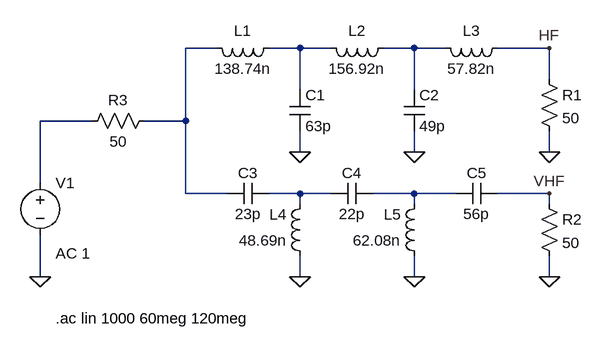
[diagram p0: schematic diplexer.asc]
diplexer.asc, the LTspice schematic file:
Version 4
SHEET 1 880 680
WIRE 224 -64 176 -64
WIRE 352 -64 304 -64
WIRE 400 -64 352 -64
WIRE 528 -64 480 -64
WIRE 576 -64 528 -64
WIRE 736 -64 656 -64
WIRE 736 -16 736 -64
WIRE 352 0 352 -64
WIRE 528 0 528 -64
WIRE 32 48 -48 48
WIRE 176 48 176 -64
WIRE 176 48 112 48
WIRE 352 96 352 64
WIRE 528 96 528 64
WIRE 736 96 736 64
WIRE -48 144 -48 48
WIRE 176 160 176 48
WIRE 240 160 176 160
WIRE 352 160 304 160
WIRE 400 160 352 160
WIRE 528 160 464 160
WIRE 592 160 528 160
WIRE 736 160 656 160
WIRE 352 176 352 160
WIRE 528 176 528 160
WIRE 736 176 736 160
WIRE -48 288 -48 224
WIRE 352 288 352 256
WIRE 528 288 528 256
WIRE 736 288 736 256
FLAG -48 288 0
FLAG 352 96 0
FLAG 528 96 0
FLAG 352 288 0
FLAG 528 288 0
FLAG 736 96 0
FLAG 736 288 0
FLAG 736 -64 HF
FLAG 736 160 VHF
SYMBOL voltage -48 128 R0
WINDOW 3 24 96 Invisible 2
WINDOW 123 24 124 Left 2
WINDOW 39 0 0 Left 0
SYMATTR Value 0
SYMATTR Value2 AC 1
SYMATTR InstName V1
SYMBOL ind 320 -80 R90
WINDOW 0 5 56 VBottom 2
WINDOW 3 32 56 VTop 2
SYMATTR InstName L1
SYMATTR Value 138.74n
SYMBOL ind 496 -80 R90
WINDOW 0 5 56 VBottom 2
WINDOW 3 32 56 VTop 2
SYMATTR InstName L2
SYMATTR Value 156.92n
SYMBOL ind 672 -80 R90
WINDOW 0 5 56 VBottom 2
WINDOW 3 32 56 VTop 2
SYMATTR InstName L3
SYMATTR Value 57.82n
SYMBOL ind 368 272 R180
WINDOW 0 36 80 Left 2
WINDOW 3 36 40 Left 2
SYMATTR InstName L4
SYMATTR Value 48.69n
SYMBOL ind 544 272 R180
WINDOW 0 36 80 Left 2
WINDOW 3 36 40 Left 2
SYMATTR InstName L5
SYMATTR Value 62.08n
SYMBOL cap 336 0 R0
SYMATTR InstName C1
SYMATTR Value 63p
SYMBOL cap 512 0 R0
SYMATTR InstName C2
SYMATTR Value 49p
SYMBOL cap 304 144 R90
WINDOW 0 0 32 VBottom 2
WINDOW 3 32 32 VTop 2
SYMATTR InstName C3
SYMATTR Value 23p
SYMBOL cap 464 144 R90
WINDOW 0 0 32 VBottom 2
WINDOW 3 32 32 VTop 2
SYMATTR InstName C4
SYMATTR Value 22p
SYMBOL cap 656 144 R90
WINDOW 0 0 32 VBottom 2
WINDOW 3 32 32 VTop 2
SYMATTR InstName C5
SYMATTR Value 56p
SYMBOL res 720 -32 R0
SYMATTR InstName R1
SYMATTR Value 50
SYMBOL res 720 160 R0
SYMATTR InstName R2
SYMATTR Value 50
SYMBOL res 128 32 R90
WINDOW 0 0 56 VBottom 2
WINDOW 3 32 56 VTop 2
SYMATTR InstName R3
SYMATTR Value 50
TEXT -24 352 Left 2 !.ac lin 1000 60meg 120meg

The netlist it stands for:
* diplexer.asc
V1 N004 0 0 AC 1
L1 N002 N001 138.74n
L2 N003 N002 156.92n
L3 HF N003 57.82n
L4 0 N005 48.69n
L5 0 N006 62.08n
C1 N002 0 63p
C2 N003 0 49p
C3 N005 N001 23p
C4 N006 N005 22p
C5 VHF N006 56p
R1 HF 0 50
R2 VHF 0 50
R3 N001 N004 50
.ac lin 1000 60meg 120meg
.backanno
.end